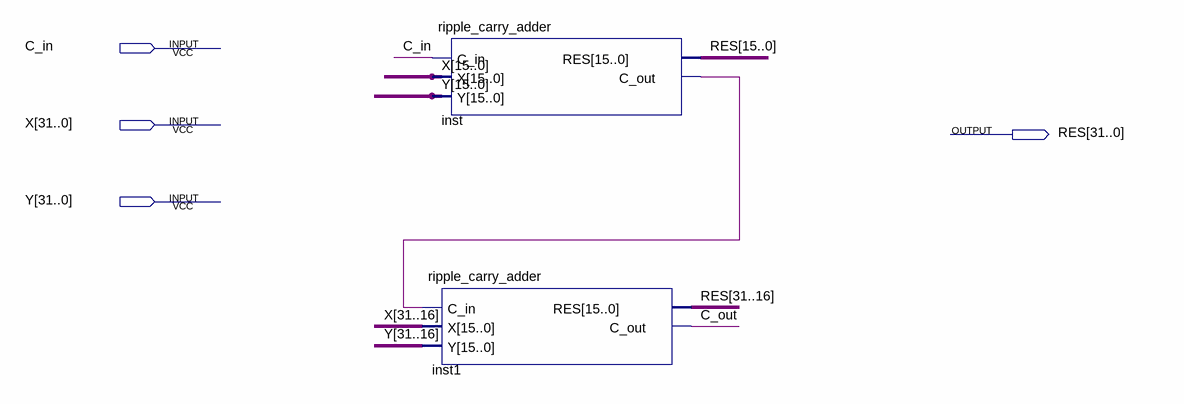
[diagram p0: schematic sheet]
// Quartus schematic ripple_carry_adder_32bit.bdf as structural Verilog: 2 symbols, 4 pins
module ripple_carry_adder_32bit (
  input  C_in,
  input  [31:0] X,
  input  [31:0] Y,
  output [31:0] RES
);

  wire C_out, inst_c_out;

  ripple_carry_adder inst1 (.C_in(inst_c_out), .X(X[31:16]), .Y(Y[31:16]), .RES(RES[31:16]), .C_out(C_out));
  ripple_carry_adder inst (.C_in(C_in), .X(X[15:0]), .Y(Y[15:0]), .RES(RES[15:0]), .C_out(inst_c_out));
endmodule
